# EAGLE design sensor_sht11_pa1 (EAGLE 4.13)
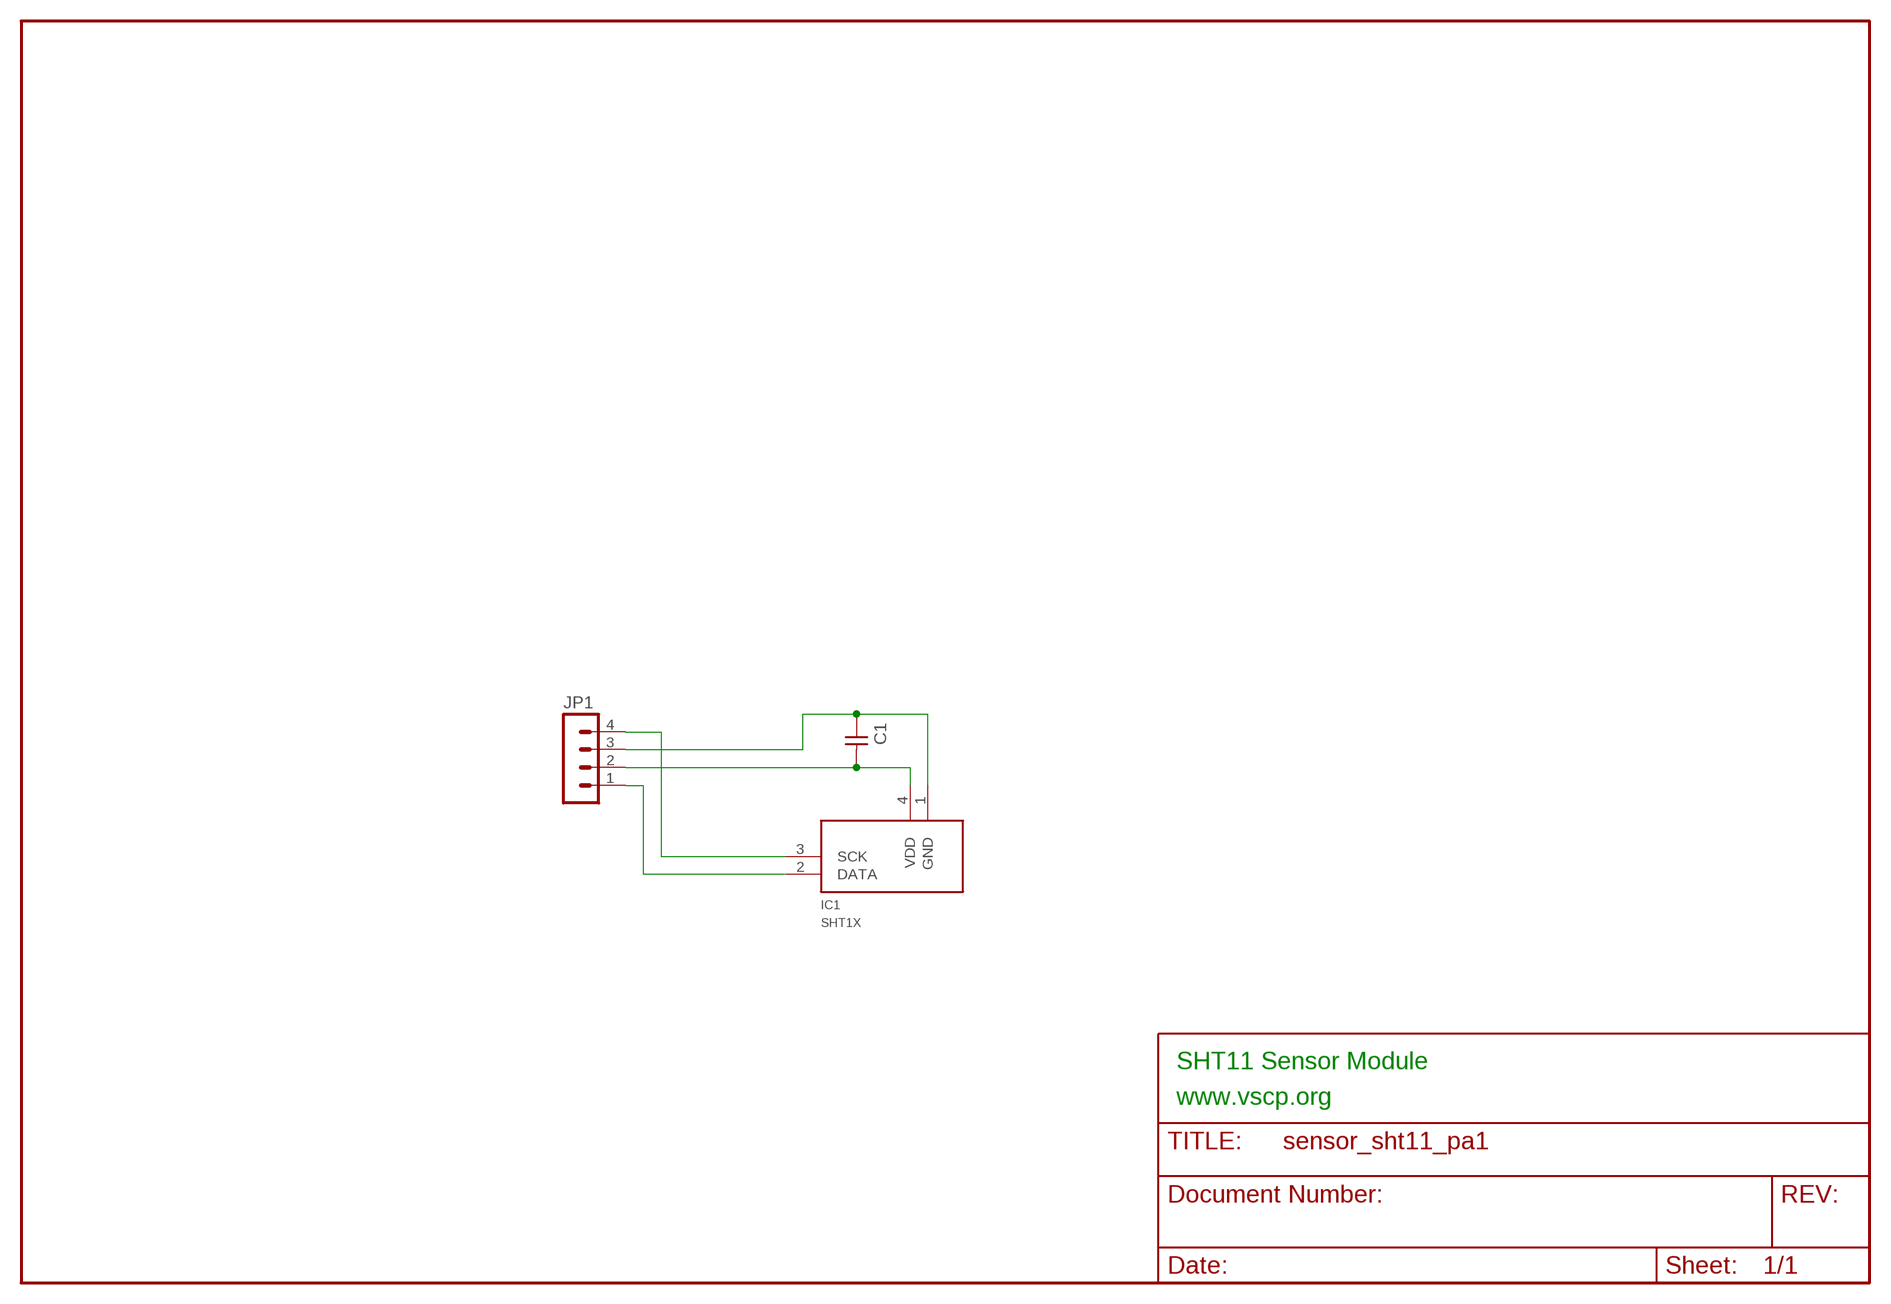
[diagram p0: schematic, sheet 1]

## Parts
C1  CAPNP-2,5  [C-2,5]
IC1  SHT1X  [SHT1X]
JP1  MA04-1  [MA04-1]

## Nets
N$1: C1.2 IC1.4(VDD) JP1.2
N$2: C1.1 IC1.1(GND) JP1.3
N$3: IC1.2(DATA) JP1.1
N$4: IC1.3(SCK) JP1.4

## Notes on the sheet
- SHT11 Sensor Module
- www.vscp.org

## Library data of the parts
C1 = discrete:CAPNP-2,5
IC1 = eurosource_vscp:SHT1X
JP1 = con-lstb:MA04-1: PIN HEADER

## Board
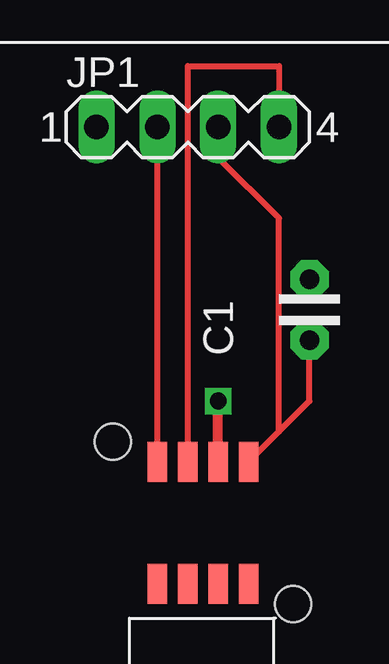
[diagram p1: board, top side]
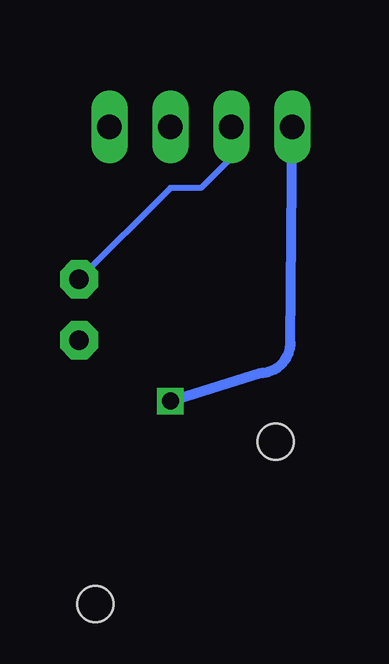
[diagram p2: board, bottom side, seen from below]

No outline drawn. Coordinates in mm, seen from the top.
Copper layers (1*16): Top 0.035mm / dielectric 1.5mm / Bottom 0.035mm
Design rules "10mils": minimum track width 10mil, minimum drill 24mil, track to track 10mil, track to pad 10mil, pad to pad 10mil, via to via 10mil, smd to smd 10mil, copper to edge 40mil, drill to drill 10mil, minimum pad ring 10mil, minimum via ring 8mil, stop-mask expansion 0mil, vias tented up to drill 0mil, thermal gap 10mil
Holes 1.5 mm at 8.31,17.35 15.83,10.59

### Footprints (pad centres in the part's own frame; a part is rotated, then mirrored left to right if it is on the bottom)
C-2,5 = drill 0.813 pad 1.6 octagon: 1 -1.27,0; 2 1.27,0
SHT1X = smd 1.676 x 0.813: 1 -2.54,2.54; 2 -2.54,1.27; 3 -2.54,0; 4 -2.54,-1.27; P$5 2.54,2.54; P$6 2.54,1.27; P$7 2.54,0; P$8 2.54,-1.27
MA04-1 = drill 1.016 long: 1 -3.81,0; 2 -1.27,0; 3 1.27,0; 4 3.81,0
LILLA_RJ11_KONTAKTEN = hole 2: 2.5,15; 21.5,15

### Placement (x,y rotation side)
C1  16.51,22.86 90 top
IC1  11.43,13.97 270 top
JP1  11.43,30.48 0 top
U$1  [LILLA_RJ11_KONTAKTEN]  0,0 0 top

### Tracks (layer width: path | path; a pad name or v marks a point on that pad's centre or on a via)
N$1
  Top 0.254: IC1.4 JP1.2
  Bottom 0.254: C1.2 12.7,27.94 11.43,27.94 10.16,29.21 JP1.2
N$2
  Top 0.254: 15.24,17.78 16.51,19.05 C1.1 | IC1.1 15.24,17.78 | 15.24,17.78 15.24,26.67 12.7,29.21 JP1.3
N$3  (via drill 0.7)
  Top 0.406: IC1.2 v12.7,19.05
  Bottom 0.406: v12.7,19.05 8.96,20.22 arc-90 7.69,21.49 JP1.1
N$4
  Top 0.254: IC1.3 11.43,33.02 15.24,33.02 JP1.4